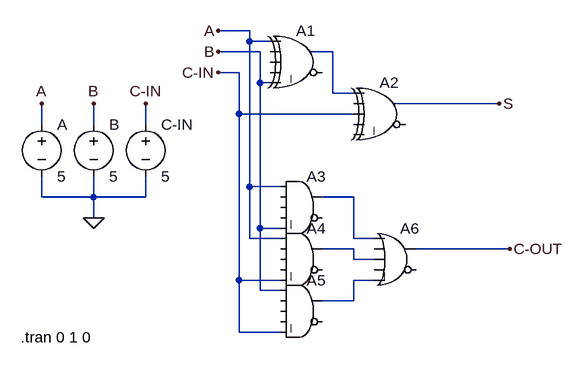
[diagram p0: schematic Pins.asc]
Pins.asc, the LTspice schematic file:
Version 4
SHEET 1 880 680
WIRE 112 -256 64 -256
WIRE 112 -240 112 -256
WIRE 144 -240 112 -240
WIRE 128 -224 64 -224
WIRE 240 -224 208 -224
WIRE 96 -192 64 -192
WIRE 128 -176 128 -224
WIRE 144 -176 128 -176
WIRE 240 -160 240 -224
WIRE 272 -160 240 -160
WIRE 496 -144 336 -144
WIRE 96 -128 96 -192
WIRE 272 -128 96 -128
WIRE -208 -112 -208 -144
WIRE -128 -112 -128 -144
WIRE -48 -112 -48 -144
WIRE 112 -16 112 -240
WIRE 160 -16 112 -16
WIRE -208 0 -208 -32
WIRE -128 0 -128 -32
WIRE -128 0 -208 0
WIRE -48 0 -48 -32
WIRE -48 0 -128 0
WIRE 272 0 224 0
WIRE -128 32 -128 0
WIRE 128 48 128 -176
WIRE 160 48 128 48
WIRE 112 64 112 -16
WIRE 160 64 112 64
WIRE 272 64 272 0
WIRE 304 64 272 64
WIRE 272 80 224 80
WIRE 512 80 368 80
WIRE 272 96 272 80
WIRE 304 96 272 96
WIRE 96 128 96 -128
WIRE 160 128 96 128
WIRE 304 128 272 128
WIRE 128 144 128 48
WIRE 160 144 128 144
WIRE 272 160 272 128
WIRE 272 160 224 160
WIRE 96 208 96 128
WIRE 160 208 96 208
FLAG -128 32 0
FLAG -208 -144 A
FLAG -128 -144 B
FLAG -48 -144 C-IN
FLAG 64 -256 A
FLAG 64 -224 B
FLAG 64 -192 C-IN
FLAG 496 -144 S
FLAG 512 80 C-OUT
SYMBOL Digital\\xor 192 -272 R0
SYMATTR InstName A1
SYMBOL Digital\\xor 320 -192 R0
SYMATTR InstName A2
SYMBOL Digital\\and 192 -48 R0
SYMATTR InstName A3
SYMBOL Digital\\and 192 32 R0
SYMATTR InstName A4
SYMBOL Digital\\and 192 112 R0
SYMATTR InstName A5
SYMBOL Digital\\or 336 32 R0
SYMATTR InstName A6
SYMBOL voltage -208 -128 R0
WINDOW 123 0 0 Left 0
WINDOW 39 0 0 Left 0
SYMATTR InstName A
SYMATTR Value 5
SYMBOL voltage -128 -128 R0
WINDOW 123 0 0 Left 0
WINDOW 39 0 0 Left 0
SYMATTR InstName B
SYMATTR Value 5
SYMBOL voltage -48 -128 R0
WINDOW 123 0 0 Left 0
WINDOW 39 0 0 Left 0
SYMATTR InstName C-IN
SYMATTR Value 5
TEXT -240 216 Left 2 !.tran 0 1 0

The netlist it stands for:
* Pins.asc
A1 A 0 0 0 B 0 N001 0 XOR
A2 N001 0 C-IN 0 0 0 S 0 XOR
A3 A 0 0 0 B 0 N002 0 AND
A4 A 0 0 0 C-IN 0 N003 0 AND
A5 B 0 0 0 C-IN 0 N004 0 AND
A6 N002 0 N003 0 N004 0 C-OUT 0 OR
V§A A 0 5
V§B B 0 5
V§C-IN C-IN 0 5
.tran 0 1 0
.backanno
.end